# EAGLE design 4BUF_1 (EAGLE 6.5.0)

## Sheet 1 of 2
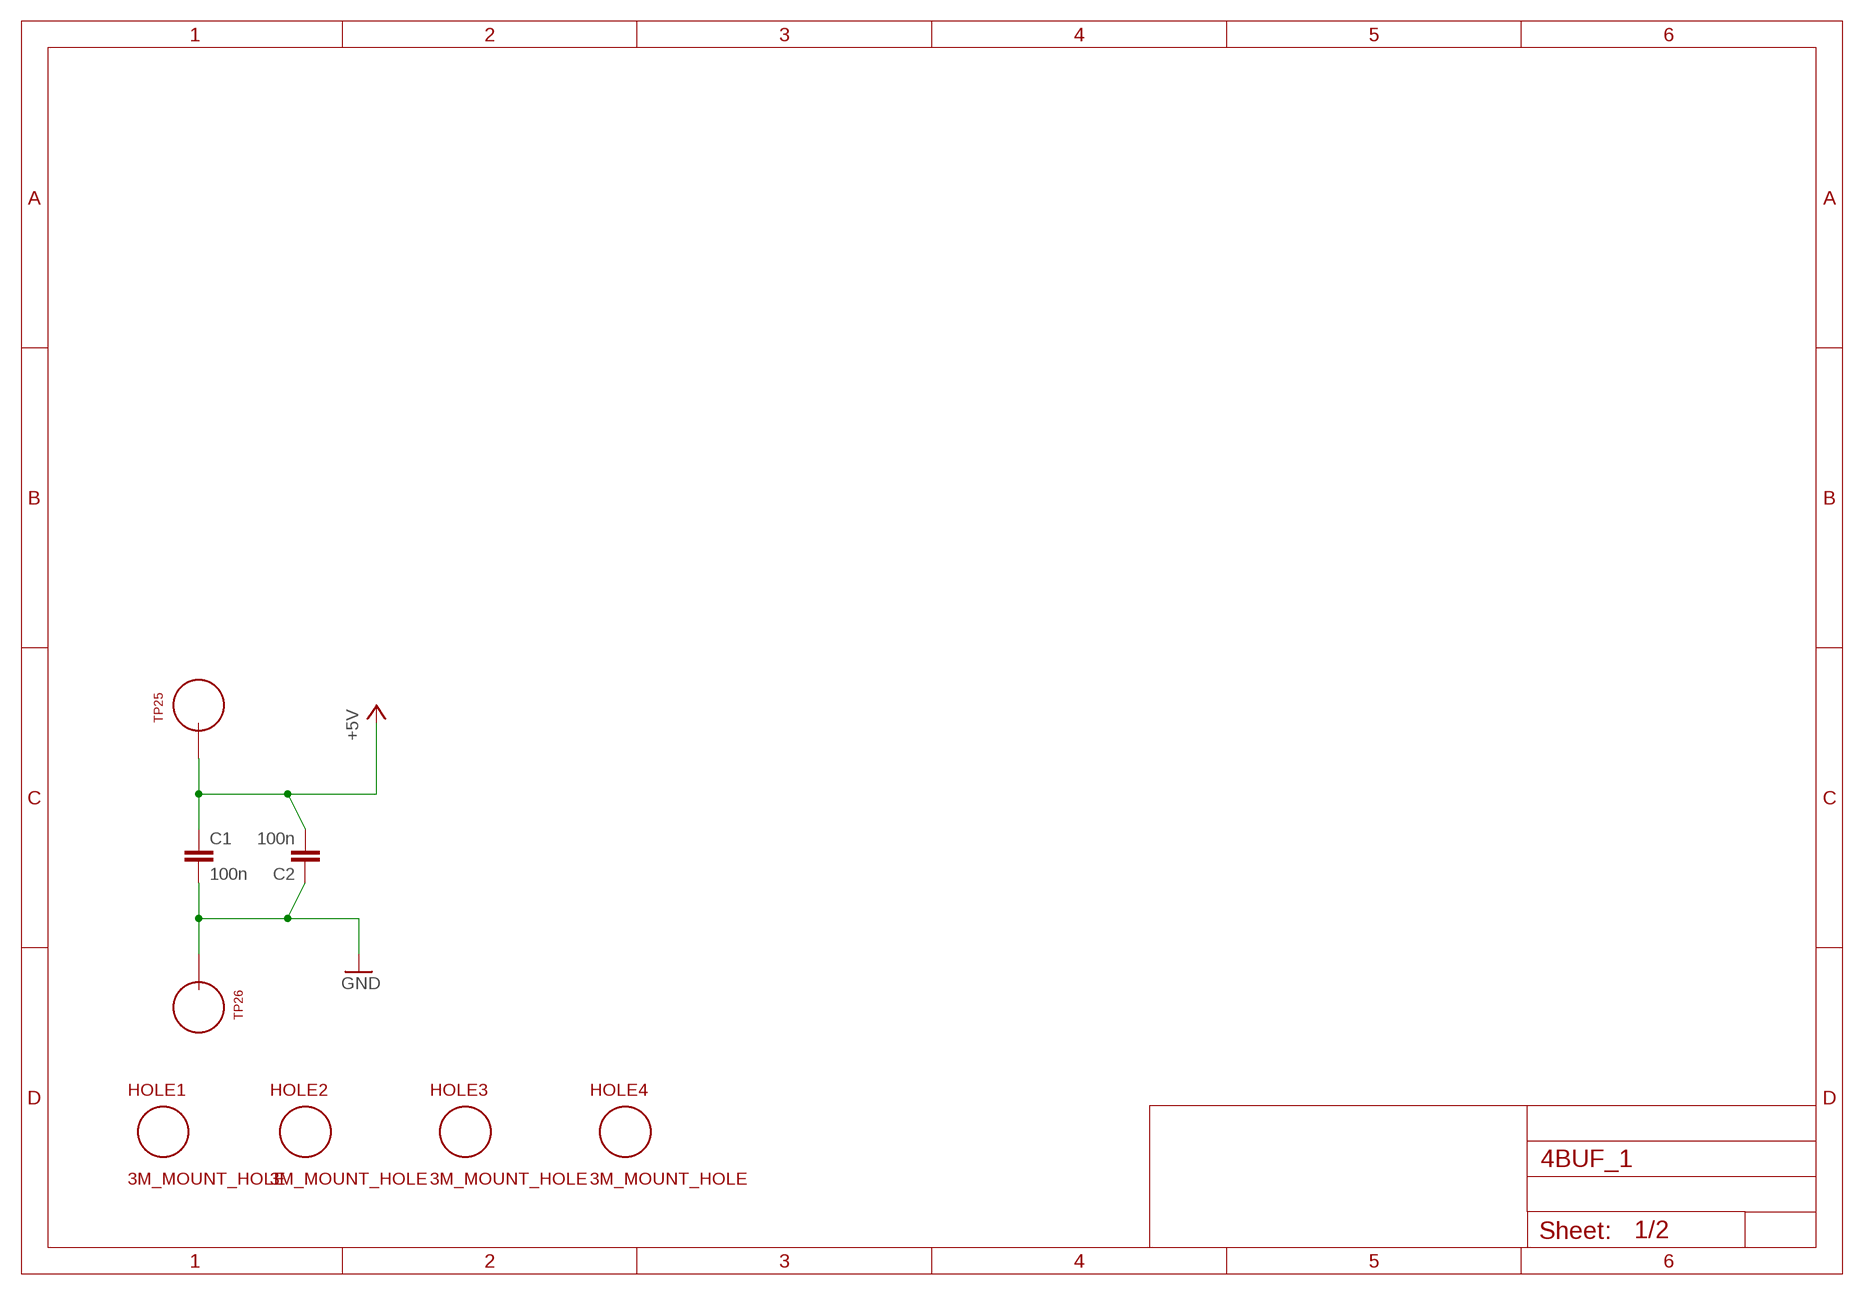
[diagram p0: schematic, sheet 1]

### Parts
C1  100n  C_P2INCH  [CAP_P2INCH]
C2  100n  C_P2INCH  [CAP_P2INCH]
HOLE1  3M_MOUNT_HOLE  [3M_HOLE]
HOLE2  3M_MOUNT_HOLE  [3M_HOLE]
HOLE3  3M_MOUNT_HOLE  [3M_HOLE]
HOLE4  3M_MOUNT_HOLE  [3M_HOLE]
TP25  TEST_LOOP  [TEST_LOOP]
TP26  TEST_LOOP  [TEST_LOOP]

### Nets
+5V: C1.1 C2.2 TP25.P$1 ; also sheet 2
GND: C1.2 C2.1 TP26.P$1 ; also sheet 2

## Sheet 2 of 2
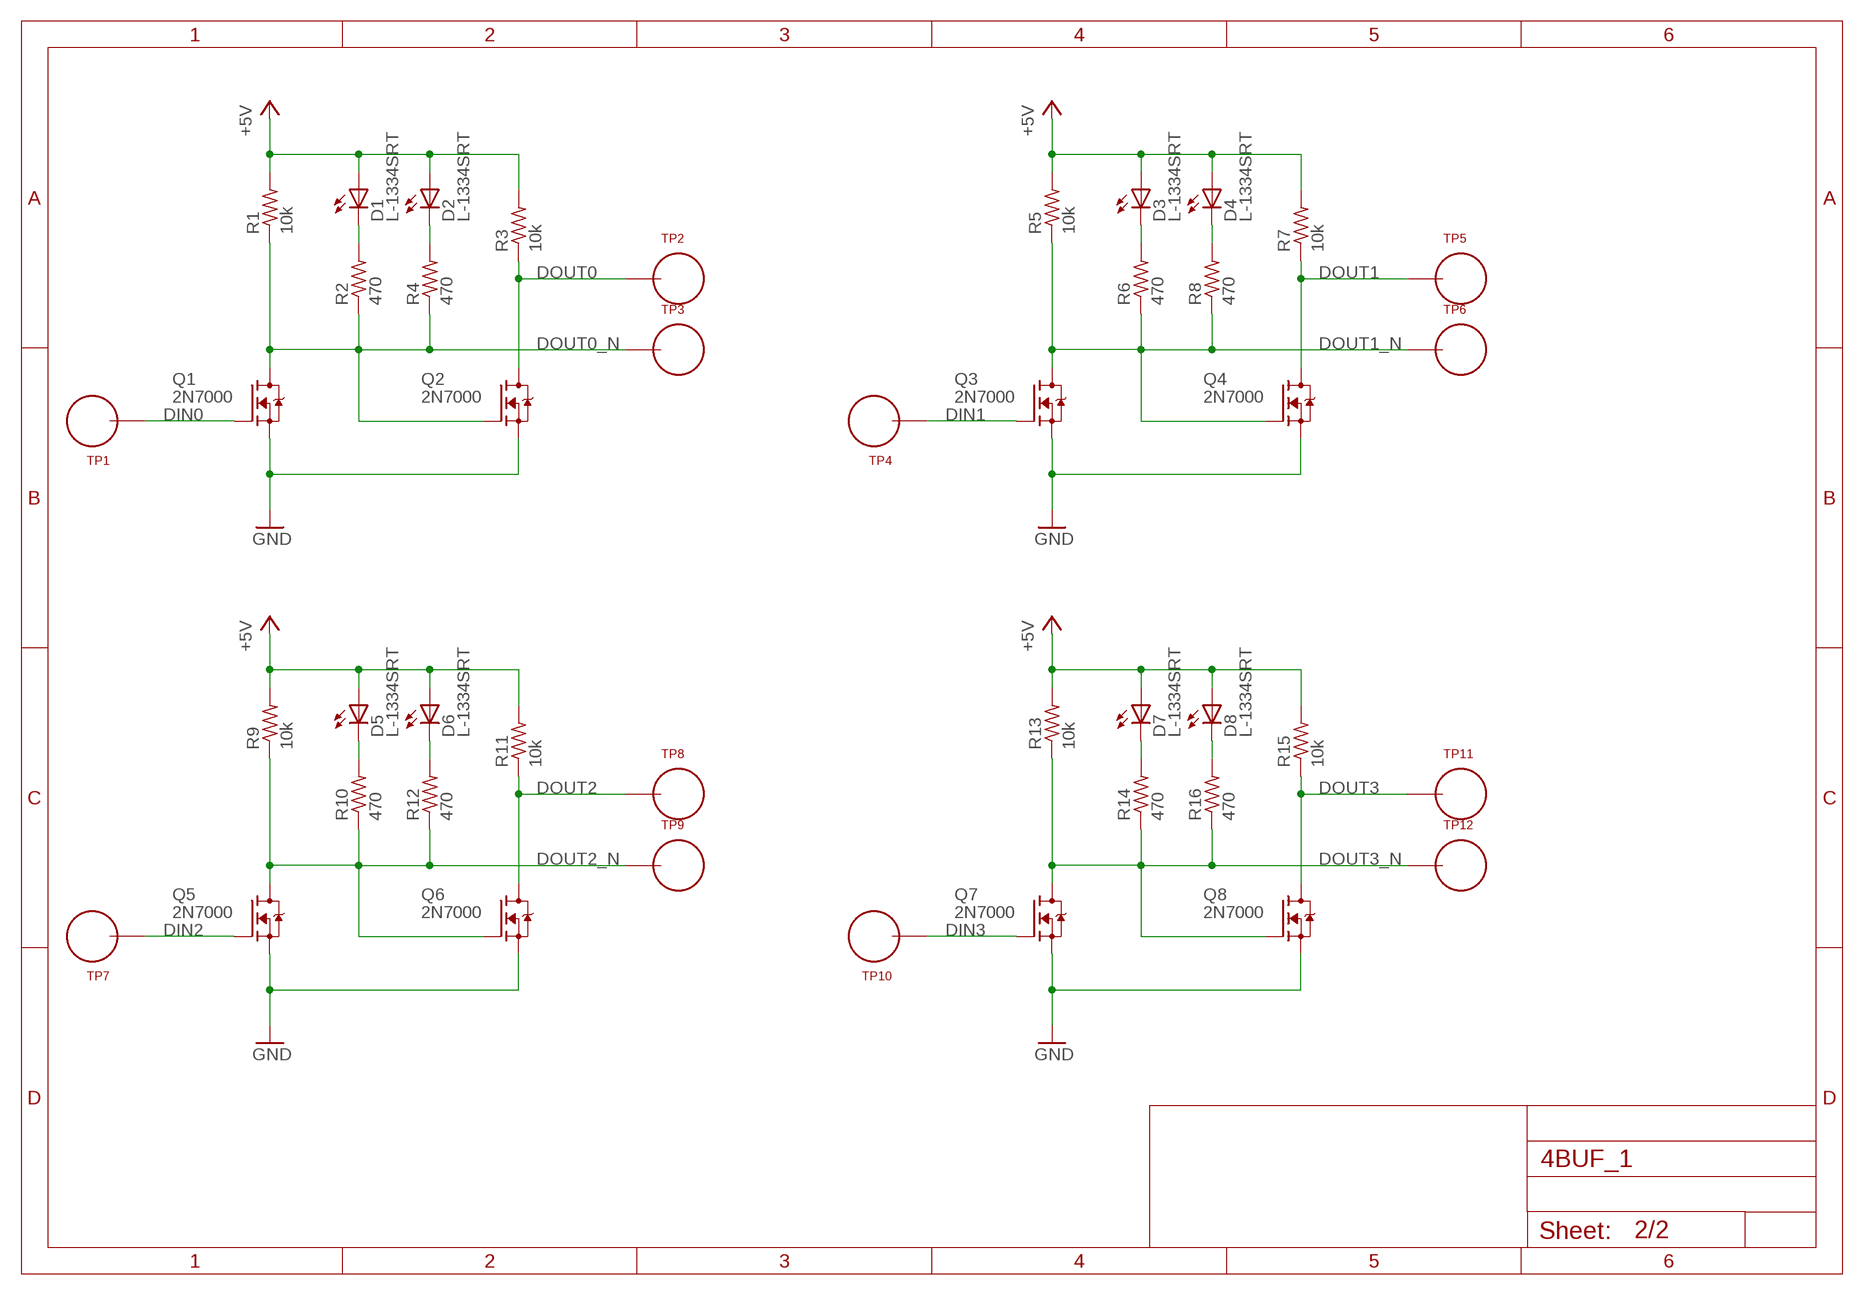
[diagram p1: schematic, sheet 2]

### Parts
D1  L-1334SRT  [LED3MM]
D2  L-1334SRT  [LED3MM]
D3  L-1334SRT  [LED3MM]
D4  L-1334SRT  [LED3MM]
D5  L-1334SRT  [LED3MM]
D6  L-1334SRT  [LED3MM]
D7  L-1334SRT  [LED3MM]
D8  L-1334SRT  [LED3MM]
Q1  2N7000  [TO92-DGS]
Q2  2N7000  [TO92-DGS]
Q3  2N7000  [TO92-DGS]
Q4  2N7000  [TO92-DGS]
Q5  2N7000  [TO92-DGS]
Q6  2N7000  [TO92-DGS]
Q7  2N7000  [TO92-DGS]
Q8  2N7000  [TO92-DGS]
R1  10k  R_P2INCH  [R_P2INCH]
R2  470  R_P2INCH  [R_P2INCH]
R3  10k  R_P2INCH  [R_P2INCH]
R4  470  R_P2INCH  [R_P2INCH]
R5  10k  R_P2INCH  [R_P2INCH]
R6  470  R_P2INCH  [R_P2INCH]
R7  10k  R_P2INCH  [R_P2INCH]
R8  470  R_P2INCH  [R_P2INCH]
R9  10k  R_P2INCH  [R_P2INCH]
R10  470  R_P2INCH  [R_P2INCH]
R11  10k  R_P2INCH  [R_P2INCH]
R12  470  R_P2INCH  [R_P2INCH]
R13  10k  R_P2INCH  [R_P2INCH]
R14  470  R_P2INCH  [R_P2INCH]
R15  10k  R_P2INCH  [R_P2INCH]
R16  470  R_P2INCH  [R_P2INCH]
TP1  TEST_LOOP  [TEST_LOOP]
TP2  TEST_LOOP  [TEST_LOOP]
TP3  TEST_LOOP  [TEST_LOOP]
TP4  TEST_LOOP  [TEST_LOOP]
TP5  TEST_LOOP  [TEST_LOOP]
TP6  TEST_LOOP  [TEST_LOOP]
TP7  TEST_LOOP  [TEST_LOOP]
TP8  TEST_LOOP  [TEST_LOOP]
TP9  TEST_LOOP  [TEST_LOOP]
TP10  TEST_LOOP  [TEST_LOOP]
TP11  TEST_LOOP  [TEST_LOOP]
TP12  TEST_LOOP  [TEST_LOOP]

### Nets
+5V: D1.A D2.A D3.A D4.A D5.A D6.A D7.A D8.A R1.2 R3.2 R5.2 R7.2 R9.2 R11.2 R13.2 R15.2 ; also sheet 1
DIN0: Q1.G TP1.P$1
DIN1: Q3.G TP4.P$1
DIN2: Q5.G TP7.P$1
DIN3: Q7.G TP10.P$1
DOUT0: Q2.D R3.1 TP2.P$1
DOUT0_N: Q1.D Q2.G R1.1 R2.1 R4.1 TP3.P$1
DOUT1: Q4.D R7.1 TP5.P$1
DOUT1_N: Q3.D Q4.G R5.1 R6.1 R8.1 TP6.P$1
DOUT2: Q6.D R11.1 TP8.P$1
DOUT2_N: Q5.D Q6.G R9.1 R10.1 R12.1 TP9.P$1
DOUT3: Q8.D R15.1 TP11.P$1
DOUT3_N: Q7.D Q8.G R13.1 R14.1 R16.1 TP12.P$1
GND: Q1.S Q2.S Q3.S Q4.S Q5.S Q6.S Q7.S Q8.S ; also sheet 1
N$1: D2.K(C) R4.2
N$2: D1.K(C) R2.2
N$3: D3.K(C) R6.2
N$4: D4.K(C) R8.2
N$5: D5.K(C) R10.2
N$6: D6.K(C) R12.2
N$7: D7.K(C) R14.2
N$8: D8.K(C) R16.2

## Library data of the parts
C1 C2 = MyLib:C_P2INCH
D1-D8 = MyLib:L-1334SRT
HOLE1-HOLE4 = MyLib:3M_MOUNT_HOLE
Q1-Q8 = MyLib:2N7000
R1-R16 = MyLib:R_P2INCH
TP1-TP12 TP25 TP26 = MyLib:TEST_LOOP

## Board
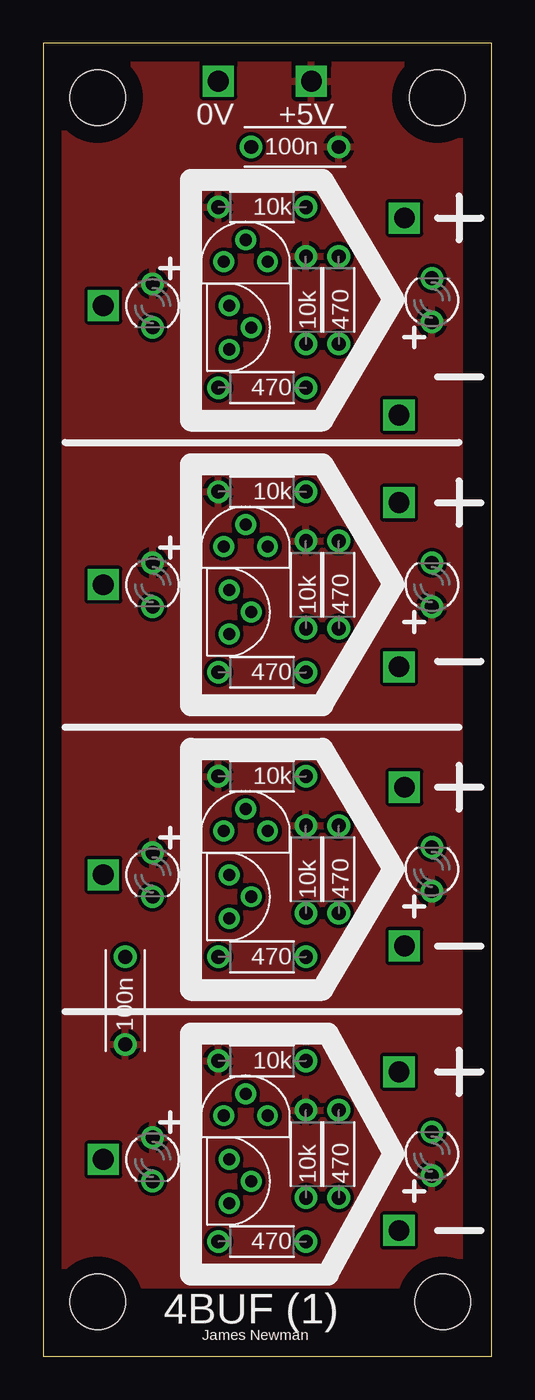
[diagram p2: board, top side]
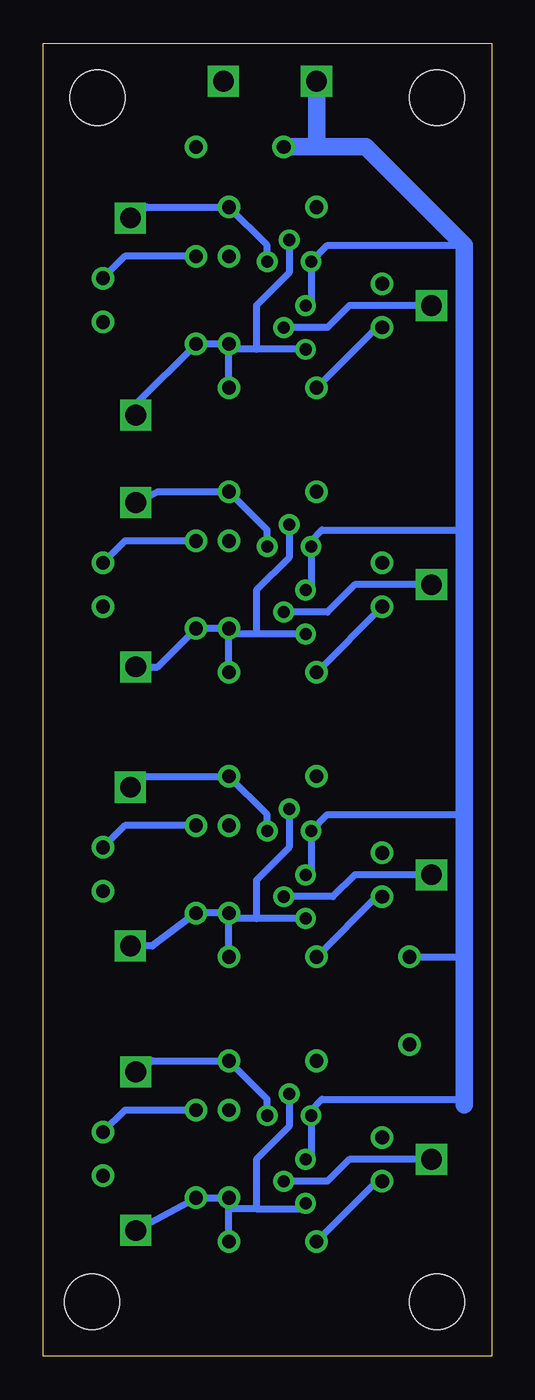
[diagram p3: board, bottom side, seen from below]

Size 26.02 x 76.19 mm. Coordinates in mm from the lower left corner, seen from the top.
Outline: 0,0 26.02,0 26.02,76.19 0,76.19 0,0
Copper layers (1*16): Top 0.035mm / dielectric 1.5mm / Bottom 0.035mm
Design rules "default": minimum track width 10mil, minimum drill 24mil, track to track 8mil, track to pad 8mil, pad to pad 8mil, via to via 8mil, smd to smd 8mil, copper to edge 40mil, drill to drill 8mil, minimum pad ring 10mil, minimum via ring 8mil, stop-mask expansion 4mil, vias tented up to drill 0mil, thermal gap 10mil

### Footprints (pad centres in the part's own frame; a part is rotated, then mirrored left to right if it is on the bottom)
CAP_P2INCH = drill 0.8: 1 -2.54,0; 2 2.54,0
LED3MM = drill 0.8: A -1.27,0; K 1.27,0
3M_HOLE = hole 3.2: 0,0
TO92-DGS = drill 0.7: D 0,1.27; G -1.27,0; S 0,-1.27
R_P2INCH = drill 0.8: 1 -2.54,0; 2 2.54,0
TEST_LOOP = drill 1.2 square: P$1 0,0

### Placement (x,y rotation side)
C1  4.76,20.64 90 top
C2  14.61,70.17 0 top
D1  6.35,11.43 270 top
D2  22.54,11.75 90 top
D3  6.35,27.94 270 top
D4  22.54,28.26 90 top
D5  6.35,44.77 270 top
D6  22.54,44.77 90 top
D7  6.35,60.96 270 top
D8  22.54,61.28 90 top
HOLE1  3.17,3.17 0 top
HOLE2  23.18,3.17 0 top
HOLE3  22.86,73.03 0 top
HOLE4  3.17,73.03 0 top
Q1  10.79,10.16 180 top
Q2  11.75,13.97 270 top
Q3  10.79,26.67 180 top
Q4  11.75,30.48 270 top
Q5  10.79,43.18 180 top
Q6  11.75,46.99 270 top
Q7  10.79,59.69 180 top
Q8  11.75,63.5 270 top
R1  15.24,11.75 90 top
R2  12.7,6.67 180 top
R3  12.7,17.14 180 top
R4  17.14,11.75 90 top
R5  15.24,28.26 90 top
R6  12.7,23.18 180 top
R7  12.7,33.66 180 top
R8  17.14,28.26 90 top
R9  15.24,44.77 90 top
R10  12.7,39.69 180 top
R11  12.7,50.16 180 top
R12  17.14,44.77 90 top
R13  15.24,61.28 90 top
R14  12.7,56.2 180 top
R15  12.7,66.67 180 top
R16  17.14,61.28 90 top
TP1  3.49,11.43 0 top
TP2  20.64,16.51 0 top
TP3  20.64,7.3 0 top
TP4  3.49,27.94 0 top
TP5  20.95,33.02 0 top
TP6  20.95,23.81 0 top
TP7  3.49,44.77 0 top
TP8  20.64,49.53 0 top
TP9  20.64,40.01 0 top
TP10  3.49,60.96 0 top
TP11  20.95,66.04 0 top
TP12  20.64,54.61 0 top
TP25  15.56,73.98 0 top
TP26  10.16,73.98 0 top

### Tracks (layer width: path | path; a pad name or v marks a point on that pad's centre or on a via)
+5V
  pour Top: 1.27,4.13 1.27,74.93 24.13,74.93 24.13,4.13
DIN0
  Bottom 0.406: TP1.P$1 8.26,11.43 9.53,10.16 Q1.G
DIN1
  Bottom 0.406: TP4.P$1 7.94,27.94 9.21,26.67 Q3.G
DIN2
  Bottom 0.406: TP7.P$1 7.94,44.77 9.53,43.18 Q5.G
DIN3
  Bottom 0.406: TP10.P$1 8.26,60.96 9.53,59.69 Q7.G
DOUT0
  Bottom 0.406: TP2.P$1 19.68,17.14 R3.1 13.02,14.92 Q2.D
DOUT0_N
  Bottom 0.406: R2.1 15.24,8.57 | 15.24,8.57 R1.1 R4.1 TP3.P$1 | 13.65,8.57 11.11,8.57 Q1.D | Q2.G 11.75,13.34 13.65,11.43 13.65,8.57 | 13.65,8.57 15.24,8.57
DOUT1
  Bottom 0.406: TP5.P$1 20.32,33.66 R7.1 13.02,31.43 Q4.D
DOUT1_N
  Bottom 0.406: R6.1 R5.1 | R5.1 R8.1 19.68,23.81 TP6.P$1 | Q3.D 13.65,25.4 | 13.65,25.4 14.92,25.4 R5.1 | Q4.G 11.75,29.53 13.65,27.62 13.65,25.4
DOUT2
  Bottom 0.406: TP8.P$1 19.37,50.16 R11.1 13.02,47.94 Q6.D
DOUT2_N
  Bottom 0.406: R10.1 R9.1 | Q5.D 13.65,41.91 | 13.65,41.91 14.92,41.91 R9.1 | R9.1 R12.1 19.37,40.01 TP9.P$1 | Q6.G 11.75,46.35 13.65,44.45 13.65,41.91
DOUT3
  Bottom 0.406: TP11.P$1 20,66.67 R15.1 13.02,64.45 Q8.D
DOUT3_N
  Bottom 0.406: R14.1 R13.1 | Q7.D 13.65,58.42 | 13.65,58.42 14.92,58.42 R13.1 | R13.1 R16.1 20.64,55.24 TP12.P$1 | Q8.G 11.75,62.87 13.65,60.96 13.65,58.42
GND
  Bottom 0.406: 1.59,64.45 9.53,64.45 Q8.S 10.48,61.28 Q7.S | 1.59,47.94 9.84,47.94 10.48,47.31 Q6.S 10.48,44.77 Q5.S | 1.59,31.43 9.53,31.43 Q4.S 10.48,28.26 Q3.S | 1.59,14.61 1.91,14.92 9.84,14.92 10.48,14.29 Q2.S 10.48,11.75 Q1.S | C1.2 1.59,23.18
  Bottom 1.016: 1.59,14.61 1.59,23.18 1.59,31.43 1.59,47.94 1.59,64.45 7.3,70.17 10.16,70.17 | TP26.P$1 10.16,70.17 | 10.16,70.17 C2.1
N$1
  Bottom 0.406: R4.2 21.27,14.29 D2.K
N$2
  Bottom 0.406: D1.K 6.99,9.84 R2.2
N$3
  Bottom 0.406: D3.K 6.67,26.67 R6.2
N$4
  Bottom 0.406: R8.2 21.27,30.8 D4.K
N$5
  Bottom 0.406: D5.K R10.2
N$6
  Bottom 0.406: R12.2 21.27,47.31 D6.K
N$7
  Bottom 0.406: D7.K 6.67,59.69 R14.2
N$8
  Bottom 0.406: R16.2 21.27,63.82 D8.K

### Text on the board
tPlace: 0V | +5V | 4BUF (1) | James Newman